# Altium schematic sheet Cover.SchDoc
size A3; Organization: Altium Limited; Address1: L3, 12a Rodborough Rd; Address2: Frenchs Forest; Address3: NSW; Address4: Australia 2086; DocumentNumber: 1; Revision: AA; SheetNumber: 1; SheetTotal: 5; ProjectDescription: Wireless Security Detector
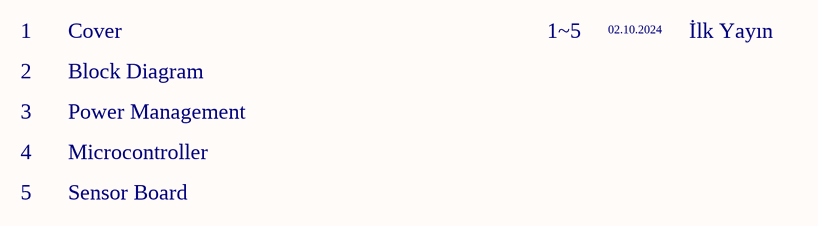
[diagram p0: Cover.SchDoc]

## Notes on the sheet
- 1
- 2
- Cover
- Block Diagram
- 1~5
- 02.10.2024
- İlk Yayın
- 3
- Power Management
- 4
- 5
- Microcontroller
- Sensor Board
- İÇİNDEKİLER / CONTENTS
- REVİZYON / REVISION
- ÜRETİM NOTLARI / PRODUCTION NOTES
- Sayfa Nu.
- Page No
- Açıklama / Description
- Tarih
- Date
- Board Features
- Kart Özellikleri
- Üretim Çıktıları
- Gerber Files
- Ekler
- Attachments
- İLETİŞİM / CONTACT
- DOSYA ADI / FILE NAME
- TANIM / DESCRIPTION
- HAZIRLAYAN / PREPARED BY
- YAYIN TARİHİ / REL. DATE
- BOYUT / SIZE
- SAYFA / SHEET
- /